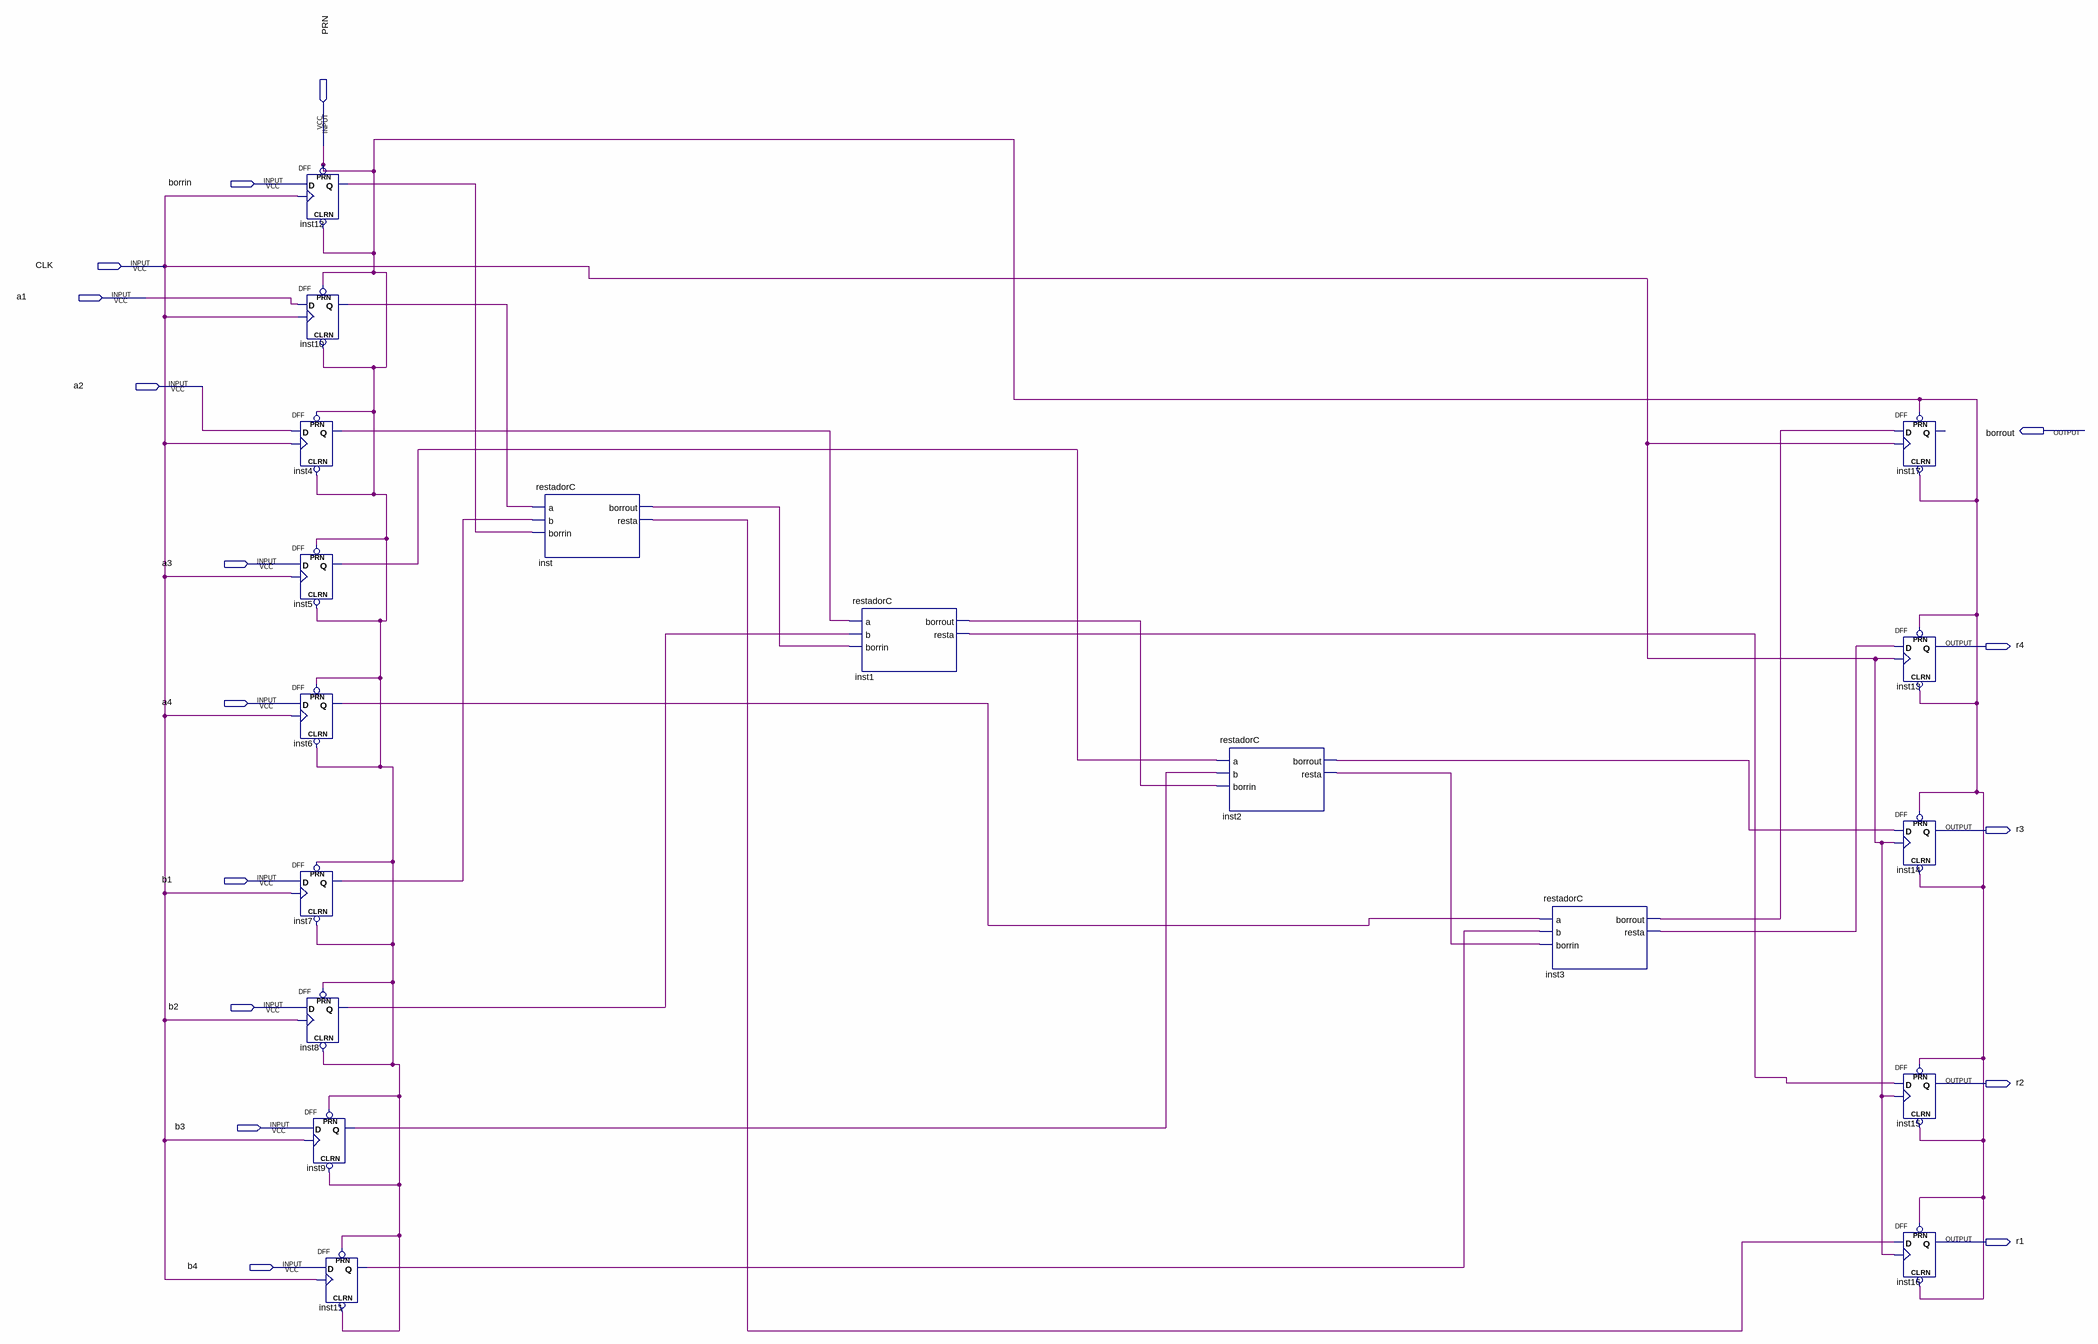
[diagram p0: schematic sheet]
// Quartus schematic esquematicoC.bdf as structural Verilog: 18 symbols, 16 pins
module esquematicoC (
  input  PRN,
  input  borrin,
  input  CLK,
  input  a1,
  input  a2,
  input  a3,
  input  a4,
  input  b1,
  input  b2,
  input  b3,
  input  b4,
  output borrout,
  output r4,
  output r3,
  output r2,
  output r1
);

  wire inst1_borrout, inst1_resta, inst2_borrout, inst2_resta, inst3_borrout, inst3_resta, inst4_q, inst5_q,
       inst6_q, inst7_q, inst8_q, inst9_q, inst10_q, inst11_q, inst12_q, inst_borrout, inst_resta;

  DFF inst12 (.CLRN(PRN), .CLK(CLK), .D(borrin), .PRN(PRN), .Q(inst12_q));
  DFF inst10 (.CLRN(PRN), .CLK(CLK), .D(a1), .PRN(PRN), .Q(inst10_q));
  DFF inst4 (.CLRN(PRN), .CLK(CLK), .D(a2), .PRN(PRN), .Q(inst4_q));
  DFF inst5 (.CLRN(PRN), .CLK(CLK), .D(a3), .PRN(PRN), .Q(inst5_q));
  DFF inst6 (.CLRN(PRN), .CLK(CLK), .D(a4), .PRN(PRN), .Q(inst6_q));
  DFF inst7 (.CLRN(PRN), .CLK(CLK), .D(b1), .PRN(PRN), .Q(inst7_q));
  DFF inst8 (.CLRN(PRN), .CLK(CLK), .D(b2), .PRN(PRN), .Q(inst8_q));
  DFF inst9 (.CLRN(PRN), .CLK(CLK), .D(b3), .PRN(PRN), .Q(inst9_q));
  DFF inst11 (.CLRN(PRN), .CLK(CLK), .D(b4), .PRN(PRN), .Q(inst11_q));
  restadorC inst (.a(inst10_q), .b(inst7_q), .borrin(inst12_q), .borrout(inst_borrout), .resta(inst_resta));
  restadorC inst1 (.a(inst4_q), .b(inst8_q), .borrin(inst_borrout), .borrout(inst1_borrout), .resta(inst1_resta));
  restadorC inst2 (.a(inst5_q), .b(inst9_q), .borrin(inst1_borrout), .borrout(inst2_borrout), .resta(inst2_resta));
  restadorC inst3 (.a(inst6_q), .b(inst11_q), .borrin(inst2_resta), .borrout(inst3_borrout), .resta(inst3_resta));
  DFF inst17 (.CLRN(PRN), .CLK(CLK), .D(inst3_borrout), .PRN(PRN));  // open: Q
  DFF inst13 (.CLRN(PRN), .CLK(CLK), .D(inst3_resta), .PRN(PRN), .Q(r4));
  DFF inst14 (.CLRN(PRN), .CLK(CLK), .D(inst2_borrout), .PRN(PRN), .Q(r3));
  DFF inst15 (.CLRN(PRN), .CLK(CLK), .D(inst1_resta), .PRN(PRN), .Q(r2));
  DFF inst16 (.CLRN(PRN), .CLK(CLK), .D(inst_resta), .PRN(PRN), .Q(r1));
endmodule
